# Altium schematic sheet mux.SchDoc: MUX
size B; Engineer: Jacob Faucett; Organization: CUAir; Address1: L3, 12a Rodborough Rd; Address2: Frenchs Forest; Address3: NSW; Address4: Australia 2086; Revision: 1; SheetNumber: 5; SheetTotal: 9; CompetitionYear: 2025; CPN: N/A; PROJECT: Current Logging and Validation Board
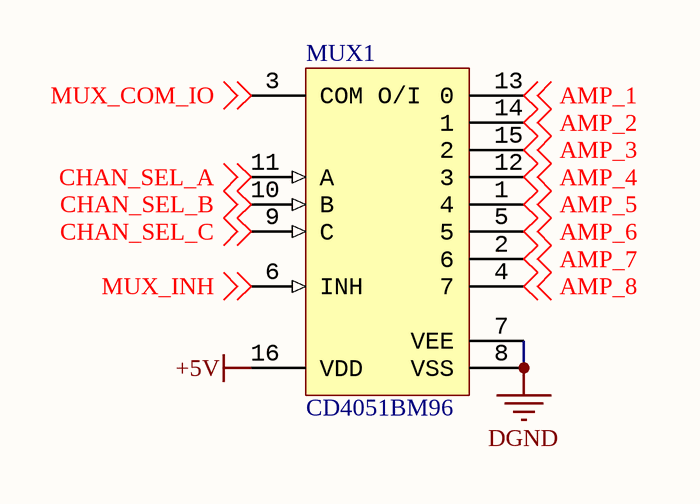
[diagram p0: mux.SchDoc]

## Parts
MUX1  CD4051BM96  [D0016A_N]

## Nets
+5V: MUX1.16(VDD)
DGND: MUX1.7(VEE) MUX1.8(VSS)
AMP_1: MUX1.13(0) ; off-sheet AMP_1
AMP_2: MUX1.14(1) ; off-sheet AMP_2
AMP_3: MUX1.15(2) ; off-sheet AMP_3
AMP_4: MUX1.12(3) ; off-sheet AMP_4
AMP_5: MUX1.1(4) ; off-sheet AMP_5
AMP_6: MUX1.5 ; off-sheet AMP_6
AMP_7: MUX1.2(6) ; off-sheet AMP_7
AMP_8: MUX1.4(7) ; off-sheet AMP_8
CHAN_SEL_A: MUX1.11(A) ; off-sheet CHAN_SEL_A
CHAN_SEL_B: MUX1.10(B) ; off-sheet CHAN_SEL_B
CHAN_SEL_C: MUX1.9(C) ; off-sheet CHAN_SEL_C
MUX_COM_IO: MUX1.3(COM_O/I) ; off-sheet MUX_COM_IO
MUX_INH: MUX1.6(INH) ; off-sheet MUX_INH

## Notes on the sheet
- Project
- Title
- Size:
- Date:
- B
- Number:
- Revision:
- File:

## Library data of the parts
MUX1 = CMP-1575-00045-4: CMOS Single 8-Channel Analog Multiplexer/Demultiplexer with Logic-Level Conversion, D0016A, LARGE T&R; Manufacturer: Texas Instruments; Ron(Typ)(Ohms): 125; Bandwidth(Max)(MHz): 20; Ron(Max)(Ohms): 240; Crosstalk: Yes; Configuration: 1 X 1：8 MUX; ICC(Typ)(mA): 0.00008; VCC(Max)(V): 18; Rating: Military; VCC(Min)(V): 5; Output Drive (IOL/IOH)(Max)(mA): 1; Code_JEDEC: MS-012 variation AC; PackageReference: D0016A; PackageVersion: http://www.ti.com/lit/ml/mpds178g/mpds178g.pdf; Generic Part Number: CD4051B; Operating Temperature Range(C): -55 to 125; Output Type: CMOS; DatasheetVersion: SCHS047G